# Altium schematic sheet pwmIC.SchDoc
size A4
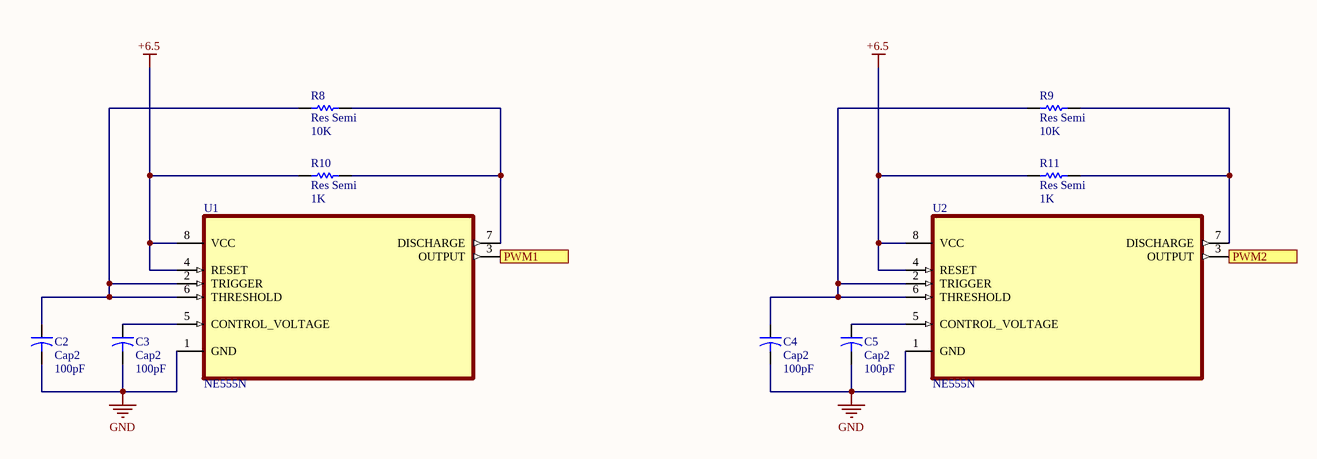
[diagram p0: pwmIC.SchDoc]

## Parts
C2  Cap2  value 100pF  [CAPR5-4X5]
C3  Cap2  value 100pF  [CAPR5-4X5]
C4  Cap2  value 100pF  [CAPR5-4X5]
C5  Cap2  value 100pF  [CAPR5-4X5]
R8  Res Semi  value 10K  [AXIAL-0.5]
R9  Res Semi  value 10K  [AXIAL-0.5]
R10  Res Semi  value 1K  [AXIAL-0.5]
R11  Res Semi  value 1K  [AXIAL-0.5]
U1  NE555N  [NE555 -T]
U2  NE555N  [NE555 -T]

## Ports
PWM1 (out), PWM2 (out)

## Nets
+6.5: R10.1 R11.1 U1.4(RESET) U1.8(VCC) U2.4(RESET) U2.8(VCC)
GND: C2.2 C3.2 C4.2 C5.2 U1.1(GND) U2.1(GND)
PWM1: U1.3(OUTPUT) ; port PWM1
PWM2: U2.3(OUTPUT) ; port PWM2
NetC2_1: C2.1 R8.1 U1.2(TRIGGER) U1.6(THRESHOLD)
NetC3_1: C3.1 U1.5(CONTROL_VOLTAGE)
NetC4_1: C4.1 R9.1 U2.2(TRIGGER) U2.6(THRESHOLD)
NetC5_1: C5.1 U2.5(CONTROL_VOLTAGE)
NetR8_2: R8.2 R10.2 U1.7(DISCHARGE)
NetR9_2: R9.2 R11.2 U2.7(DISCHARGE)

## Library data of the parts
C2-C5 = Cap2: Capacitor; Published: 23-Sep-2002; PackageReference: CAPR5-4X5; Publisher: Altium Limited; PackageDescription: Capacitor; 2 Leads
R8-R11 = Res Semi: Semiconductor Resistor; Published: 8-Jun-2000; LatestRevisionDate: 17-Jul-2002; LatestRevisionNote: Re-released for DXP Platform.; PackageReference: AXIAL-0.5; Publisher: Altium Limited; PackageDescription: Axial Device, Thru-Hole; 2 Leads; 0.5 in Pin Spacing
U1 U2 = NE555N: 555 Type, Timer/Oscillator _Single_ IC 8-DIP; MF: ON Semiconductor; Value: *; Price: None; Package: DIP-8 Texas Instruments; SnapEDA_Link: https://www.snapeda.com/parts/NE555N/ON%20Semiconductor/view-part/2757993/?ref=snap; Availability: Unavailable; MP: NE555N